# EAGLE schematic encoder (EAGLE 6.4)
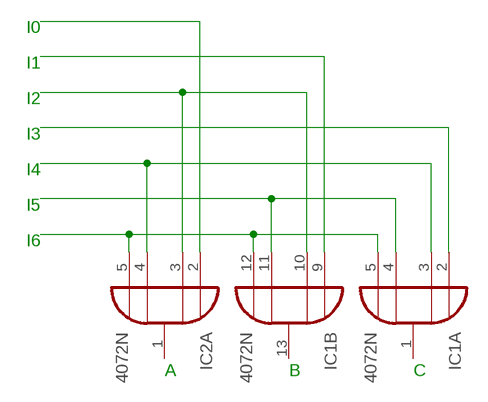
[diagram p0: schematic, sheet 1]

## Parts
IC1  4072N  [DIL14]
IC2  4072N  [DIL14]

## Nets
N$2: IC2.2(A:I0)
N$3: IC1.10(B:I1) IC2.3(A:I1)
N$4: IC1.3(A:I1) IC2.4(A:I2)
N$5: IC1.5(A:I3) IC1.12(B:I3) IC2.5(A:I3)
N$8: IC1.4(A:I2) IC1.11(B:I2)
N$9: IC1.2(A:I0)
N$10: IC1.9(B:I0)
Unconnected: IC1.1(A:O) IC1.13(B:O) IC2.1(A:O) IC2.9(B:I0) IC2.10(B:I1) IC2.11(B:I2) IC2.12(B:I3) IC2.13(B:O)

## Notes on the sheet
- I0
- I1
- I2
- I3
- I4
- I5
- I6
- A | B | C

## Power pins joined to a net without a drawn wire
VDD: IC1.14(P:VDD) IC2.14(P:VDD)
VSS: IC1.7(P:VSS) IC2.7(P:VSS)

## Library data of the parts
IC1 IC2 = 40xx:4072: Dual 4-input OR